# EAGLE design Servo (EAGLE 9.6.2)
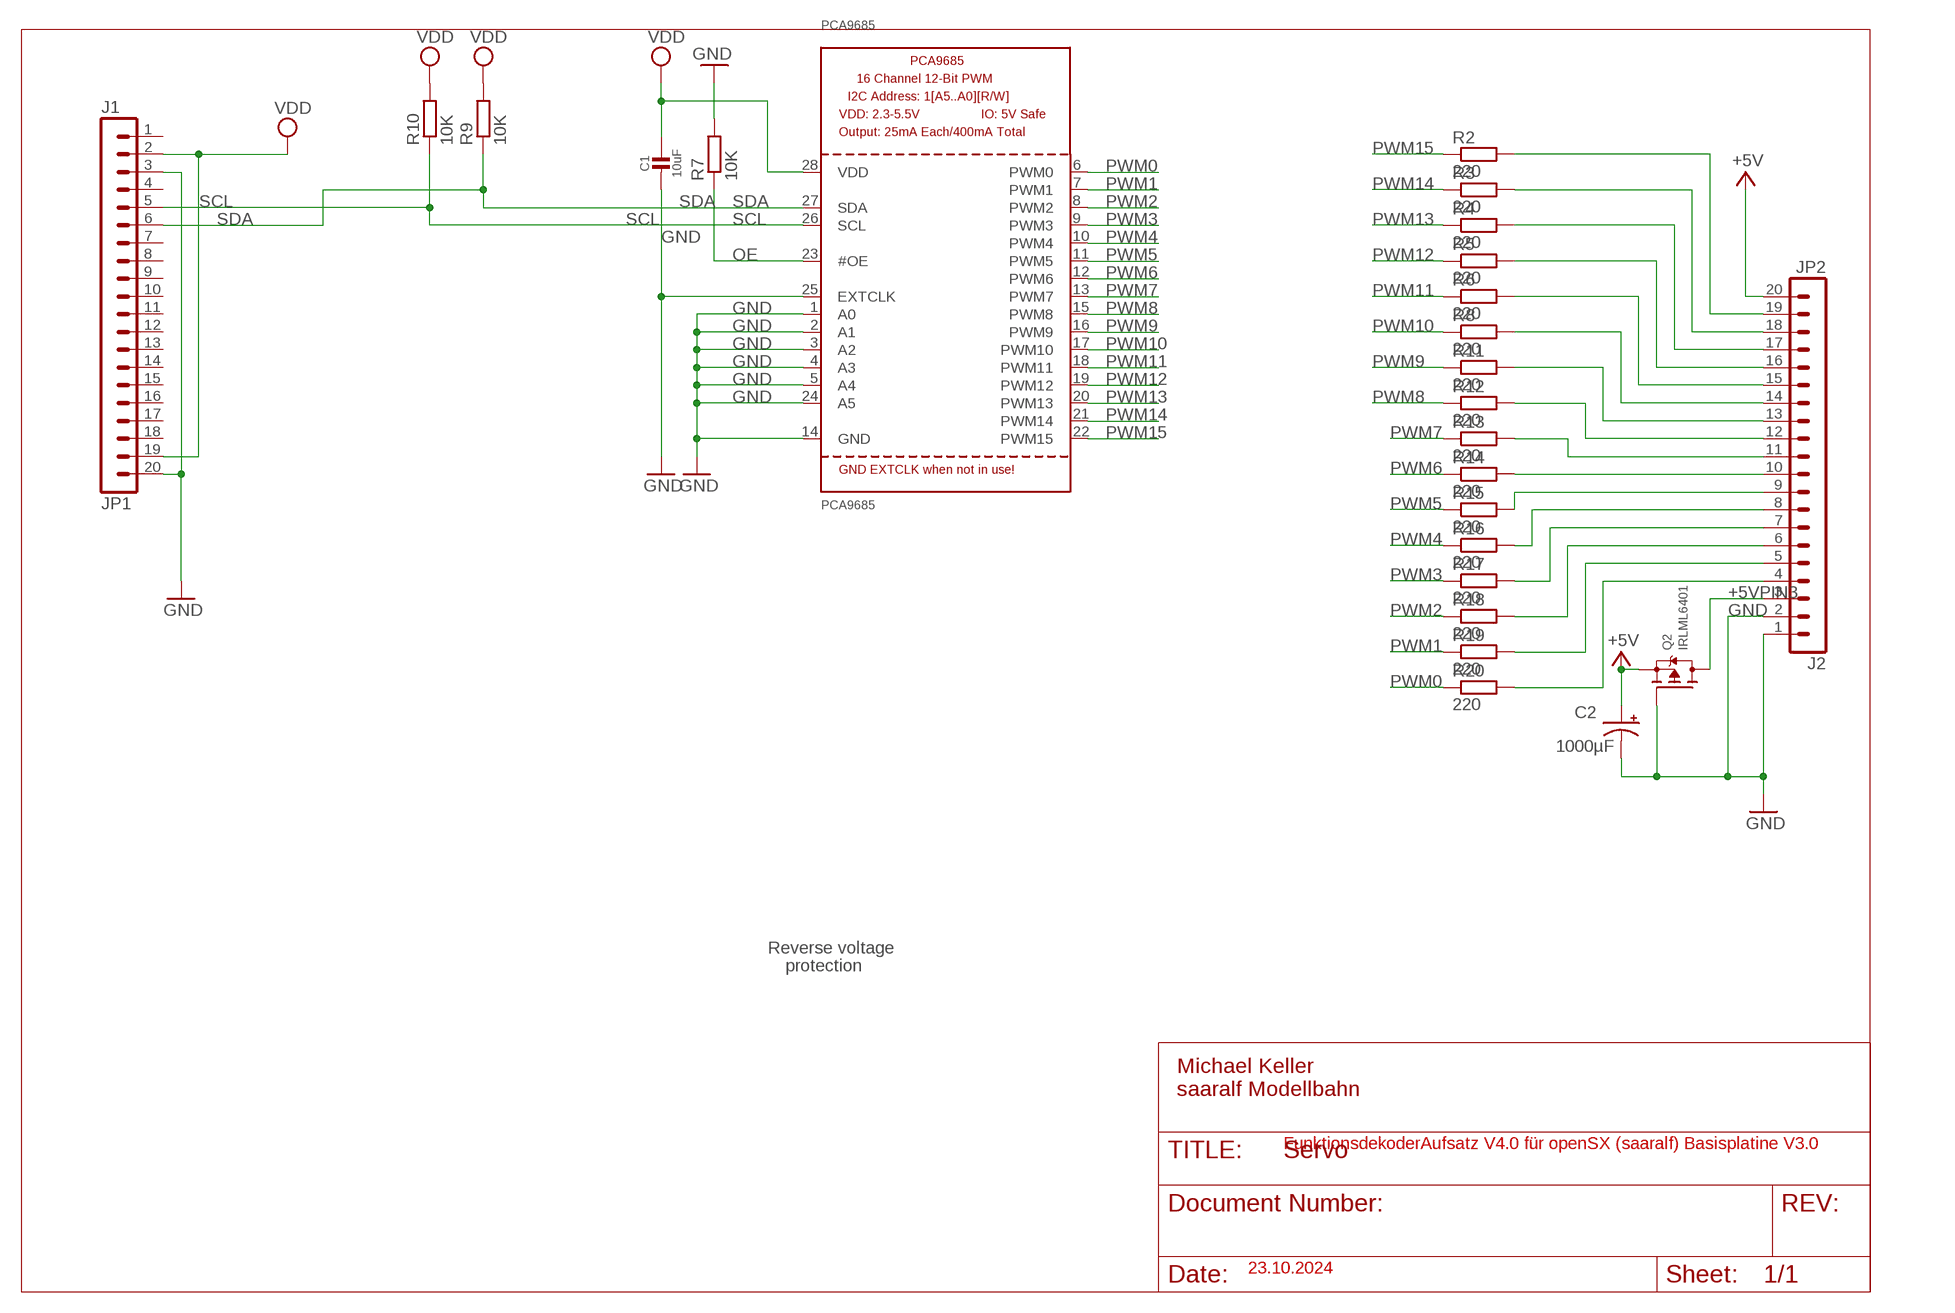
[diagram p0: schematic, sheet 1]

## Parts
C1  10uF  CAP_CERAMIC0805-NOOUTLINE  [0805-NO]
C2  1000µF  CPOL-USE3.5-8  [E3,5-8]
JP1  J1  MA20-1  [MA20-1]
JP2  J2  MA20-1  [MA20-1]
PCA9685  PCA9685  [TSSOP28]
Q2  IRLML6401  MOSFET-PWIDE  [SOT23-WIDE]
R2  220  R-EU_M0805  [M0805]
R3  220  R-EU_M0805  [M0805]
R4  220  R-EU_M0805  [M0805]
R5  220  R-EU_M0805  [M0805]
R6  220  R-EU_M0805  [M0805]
R7  10K  R-EU_M0805  [M0805]
R8  220  R-EU_M0805  [M0805]
R9  10K  R-EU_M0805  [M0805]
R10  10K  R-EU_M0805  [M0805]
R11  220  R-EU_M0805  [M0805]
R12  220  R-EU_M0805  [M0805]
R13  220  R-EU_M0805  [M0805]
R14  220  R-EU_M0805  [M0805]
R15  220  R-EU_M0805  [M0805]
R16  220  R-EU_M0805  [M0805]
R17  220  R-EU_M0805  [M0805]
R18  220  R-EU_M0805  [M0805]
R19  220  R-EU_M0805  [M0805]
R20  220  R-EU_M0805  [M0805]

## Nets
+5V: C2.+ JP2.20 Q2.2(S)
+5VPIN3: JP2.3 Q2.3(D)
GND: C1.2 C2.- JP1.3 JP1.20 JP2.1 JP2.2 PCA9685.1(A0) PCA9685.2(A1) PCA9685.3(A2) PCA9685.4(A3) PCA9685.5(A4) PCA9685.14(GND) PCA9685.24(A5) PCA9685.25(EXTCLK) Q2.1(G) R7.2
N$2: JP2.17 R4.2
N$3: JP2.11 R13.2
N$4: JP2.10 R14.2
N$5: JP2.9 R15.2
N$6: JP2.7 R17.2
N$7: JP2.6 R18.2
N$8: JP2.5 R19.2
N$9: JP2.4 R20.2
N$10: JP2.15 R6.2
N$11: JP2.14 R8.2
N$12: JP2.18 R3.2
N$13: JP2.13 R11.2
N$14: JP2.19 R2.2
N$15: JP2.8 R16.2
N$17: JP2.16 R5.2
N$18: JP2.12 R12.2
OE: PCA9685.23(#OE) R7.1
PWM0: PCA9685.6(PWM0) R20.1
PWM1: PCA9685.7(PWM1) R19.1
PWM2: PCA9685.8(PWM2) R18.1
PWM3: PCA9685.9(PWM3) R17.1
PWM4: PCA9685.10(PWM4) R16.1
PWM5: PCA9685.11(PWM5) R15.1
PWM6: PCA9685.12(PWM6) R14.1
PWM7: PCA9685.13(PWM7) R13.1
PWM8: PCA9685.15(PWM8) R12.1
PWM9: PCA9685.16(PWM9) R11.1
PWM10: PCA9685.17(PWM10) R8.1
PWM11: PCA9685.18(PWM11) R6.1
PWM12: PCA9685.19(PWM12) R5.1
PWM13: PCA9685.20(PWM13) R4.1
PWM14: PCA9685.21(PWM14) R3.1
PWM15: PCA9685.22(PWM15) R2.1
SCL: JP1.5 PCA9685.26(SCL) R10.1
SDA: JP1.6 PCA9685.27(SDA) R9.1
VDD: C1.1 JP1.2 JP1.19 PCA9685.28(VDD) R9.2 R10.2
Unconnected: JP1.1 JP1.4 JP1.7 JP1.8 JP1.9 JP1.10 JP1.11 JP1.12 JP1.13 JP1.14 JP1.15 JP1.16 JP1.17 JP1.18

## Notes on the sheet
- Reverse voltage
- protection
- Michael Keller
  saaralf Modellbahn
- FunktionsdekoderAufsatz V4.0 für openSX (saaralf) Basisplatine V3.0
- 23.10.2024

## Library data of the parts
C1 = microbuilder:CAP_CERAMIC: Ceramic Capacitors For new designs, use the packages preceded by an '_' character since they are more reliable: The following footprints should be used on most boards: _0402 - Standard footprint for regular board layouts _0603 - Standard footprint for regular board layouts _0805 - Standard footprint for regular board layouts _1206 - Standard footprint for regular board layouts For extremely tight-pitch boards where space is at a premium, the following 'micro-pitch' footprints can be used (smaller pads, no silkscreen outline, etc.): _0402MP - Micro-pitch footprint for very dense/compact boards _0603MP - Micro-pitch footprint for very dense/compact boards _0805MP - Micro-pitch footprint for very dense/compact boards _1206MP - Micro-pitch footprint for very dense/compact boards
C2 = adafruit:CPOL-US: POLARIZED CAPACITOR, American symbol
JP1 JP2 = con-lstb:MA20-1: PIN HEADER; OC_FARNELL: unknown; OC_NEWARK: unknown
PCA9685 = microbuilder:PCA9685: PCA9685 - 16 Channel 12-Bit I2C PWM Controller 5.0V tolerant 16 channel, 12-bit I2C PWM controller with 25mA per output (max. 400mA total) Digikey: 568-5931-1-ND
Q2 = microbuilder:MOSFET-P: P-Channel Mosfet LEGEND VDS: Voltage Drain-Source ID: Drain Current RDS(ON): Drain-Source On-State Resistance VGS(TH): Gate-Source Threshold Voltage CISS: Drain-Source Input Capacitance SOT-23 Name VDS ID RDS(ON) VGS(TH) CISS Order Number IRLML5103 30V 760mA 600 mOhm -- 75pF @ 25V Digikey: IRLML5103PBFCT-ND NTR0202PL 20V 400mA 800 mOhm 2.3V @ 250uA 70pF @ 5V Digikey: NTR0202PLT1GOSTR-ND NTR4101PT1G 20V 1.8A 85 mOhm 1.2V @ 250uA 675pF @ 10V Digikey: NTR4101PT1GOSCT-ND DMP2004K 20V 600mA 900 mOhm 1V @ 250uA 175pF @ 16V Digikey: DMP2004KDICT-ND PMV65XP 20V 3.9A 76 mOhm 950mV @ 1mA 725pF @ 20V Digikey: 568-2358-2-ND TO-252 Name VDS ID RDS(ON) VGS(TH) CISS Order Number AOD417 30V 25A 34 mOhm 3V @ 250µA 920pF @ 15V Digikey: 785-1106-2-ND
R2-R20 = rcl:R-EU_: RESISTOR, European symbol; SPICEPREFIX: R

## Board
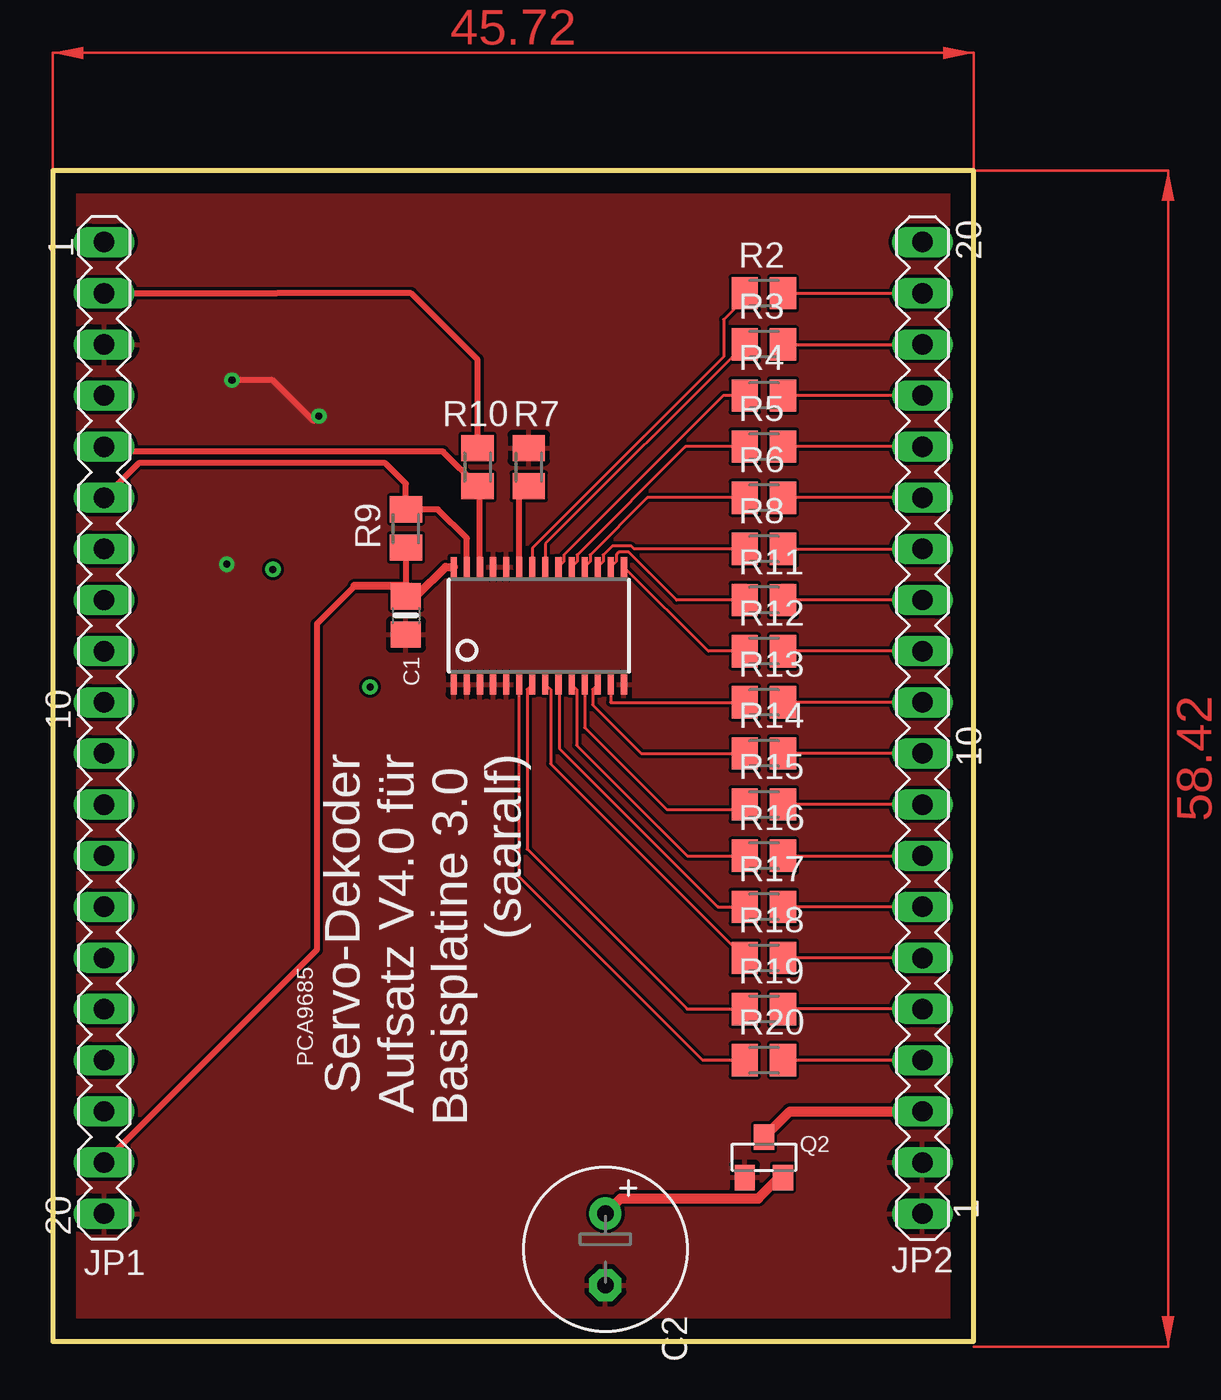
[diagram p1: board, top side]
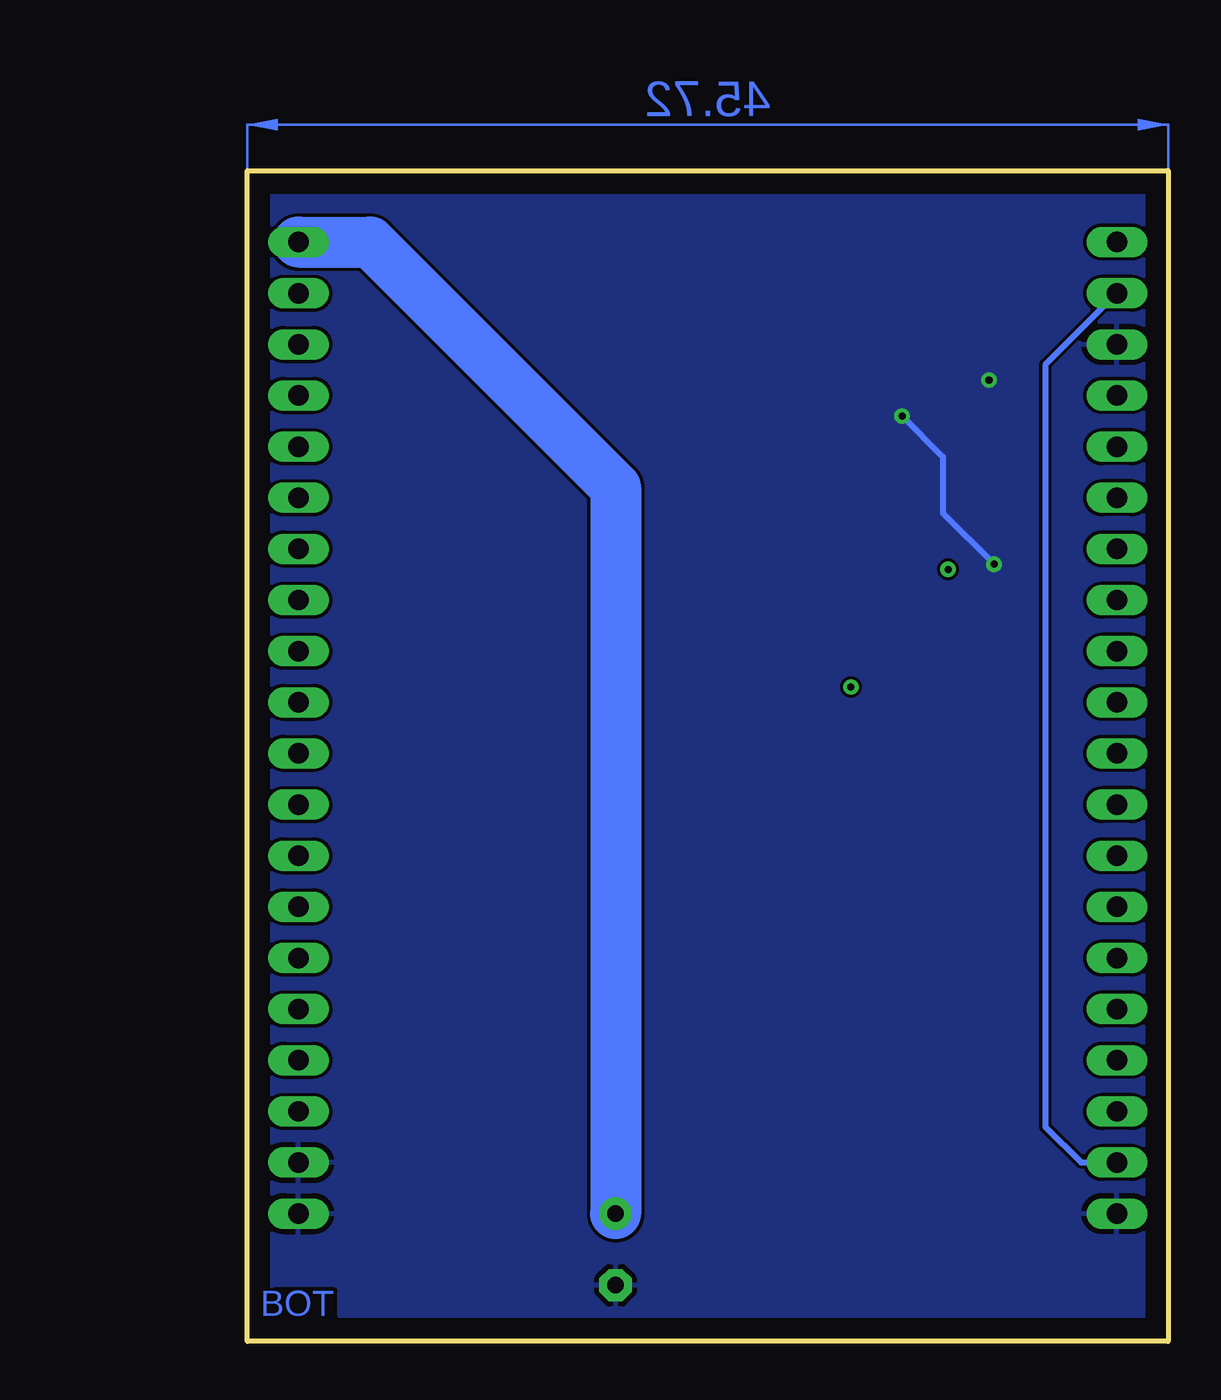
[diagram p2: board, bottom side, seen from below]

Size 45.72 x 58.17 mm. Coordinates in mm from the lower left corner, seen from the top.
Outline: 0,0 45.72,0 45.72,58.17 0,58.17 0,0
Copper layers (1*16): Top 0.035mm / dielectric 1.5mm / Bottom 0.035mm
Design rules "default": minimum track width 6mil, minimum drill 0.35mm, track to track 6mil, track to pad 6mil, pad to pad 6mil, via to via 6mil, smd to smd 6mil, copper to edge 40mil, drill to drill 6mil, minimum pad ring 10mil, minimum via ring 8mil, stop-mask expansion 4mil, vias tented up to drill 0mil, thermal gap 10mil

### Footprints (pad centres in the part's own frame; a part is rotated, then mirrored left to right if it is on the bottom)
0805-NO = smd 1.3 x 1.5: 1 -0.95,0; 2 0.95,0
E3,5-8 = drill 0.813 pad 1.6: + -1.778,0 | drill 0.813 pad 1.6 octagon: - 1.778,0
MA20-1 = drill 1.016 long: 1 -24.13,0; 2 -21.59,0; 3 -19.05,0; 4 -16.51,0; 5 -13.97,0; 6 -11.43,0; 7 -8.89,0; 8 -6.35,0; 9 -3.81,0; 10 -1.27,0; 11 1.27,0; 12 3.81,0; 13 6.35,0; 14 8.89,0; 15 11.43,0; 16 13.97,0; 17 16.51,0; 18 19.05,0; 19 21.59,0; 20 24.13,0
TSSOP28 = smd 0.305 x 0.991: 1 -4.225,-2.918; 2 -3.575,-2.918; 3 -2.925,-2.918; 4 -2.275,-2.918; 5 -1.625,-2.918; 6 -0.975,-2.918; 7 -0.325,-2.918; 8 0.325,-2.918; 9 0.975,-2.918; 10 1.625,-2.918; 11 2.275,-2.918; 12 2.925,-2.918; 13 3.575,-2.918; 14 4.225,-2.918; 15 4.225,2.918; 16 3.575,2.918; 17 2.925,2.918; 18 2.275,2.918; 19 1.625,2.918; 20 0.975,2.918; 21 0.325,2.918; 22 -0.325,2.918; 23 -0.975,2.918; 24 -1.625,2.918; 25 -2.275,2.918; 26 -2.925,2.918; 27 -3.575,2.918; 28 -4.225,2.918
SOT23-WIDE = smd 1 x 1.27: 1 -0.95,-1; 2 0.95,-1; 3 0,1
M0805 = smd 1.3 x 1.6: 1 -0.95,0; 2 0.95,0

### Placement (x,y rotation side)
C1  17.53,36.07 270 top
C2  27.43,4.57 270 top
JP1  2.54,30.48 270 top
JP2  43.18,30.48 90 top
PCA9685  24.13,35.56 0 top
Q2  35.31,9.14 0 top
R2  35.31,52.07 0 top
R3  35.31,49.53 0 top
R4  35.31,46.99 0 top
R5  35.31,44.45 0 top
R6  35.31,41.91 0 top
R7  23.62,43.43 90 top
R8  35.31,39.37 0 top
R9  17.53,40.39 270 top
R10  21.08,43.43 90 top
R11  35.31,36.83 0 top
R12  35.31,34.29 0 top
R13  35.31,31.75 0 top
R14  35.31,29.21 0 top
R15  35.31,26.67 0 top
R16  35.31,24.13 0 top
R17  35.31,21.59 0 top
R18  35.31,19.05 0 top
R19  35.31,16.51 0 top
R20  35.31,13.97 0 top

### Tracks (layer width: path | path; a pad name or v marks a point on that pad's centre or on a via)
+5V
  Top 0.508: Q2.2 36.07,8.14 35.02,7.1 28.18,7.1 C2.+
  Bottom 2.54: JP2.20 39.62,54.61 27.43,42.42 C2.+
+5VPIN3
  Top 0.508: Q2.3 36.59,11.43 JP2.3
GND  (via drill 0.35)
  Top 0.254: PCA9685.2 20.59,32.61 20.59,32.29
  Top 0.305: v13.21,45.97 12.95,45.72 10.92,47.75 v8.89,47.75
  Bottom 0.305: v13.21,45.97 11.18,43.94 11.18,41.15 v8.64,38.61
  pour Top: 45.97,58.42 45.97,0.25 45.72,0 0,0 0.26,58.42
  pour Bottom: 0,58.17 45.47,58.17 45.72,58.42 45.72,0 0,0
N$1  (via drill 0.35)
  other vias: 10.92,38.35
N$2
  Top 0.152: JP2.17 R4.2
N$3
  Top 0.152: JP2.11 R13.2
N$4
  Top 0.152: JP2.10 R14.2
N$5
  Top 0.152: JP2.9 R15.2
N$6
  Top 0.152: JP2.7 R17.2
N$7
  Top 0.152: JP2.6 R18.2
N$8
  Top 0.152: JP2.5 R19.2
N$9
  Top 0.152: JP2.4 R20.2
N$10
  Top 0.152: JP2.15 R6.2
N$11
  Top 0.152: R8.2 JP2.14
N$12
  Top 0.152: R3.2 JP2.18
N$13
  Top 0.152: JP2.13 R11.2
N$14
  Top 0.152: R2.2 JP2.19
N$15
  Top 0.152: R16.2 JP2.8
N$16  (via drill 0.35)
  other vias: 15.75,32.51
N$17
  Top 0.152: JP2.16 R5.2
N$18
  Top 0.152: JP2.12 R12.2
OE
  Top 0.305: PCA9685.23 23.16,42.02 R7.1
PWM0
  Top 0.152: R20.1 32.26,13.97 23.16,23.07 PCA9685.6
PWM1
  Top 0.152: PCA9685.7 23.55,32.39 23.55,24.45 31.5,16.51 R19.1
PWM2
  Top 0.152: R18.1 24.71,28.7 24.71,32.39 PCA9685.8
PWM3
  Top 0.152: PCA9685.9 25.15,32.6 25.15,29.46 33.02,21.59 R17.1
PWM4
  Top 0.152: PCA9685.10 26.01,32.39 26.01,29.62 31.5,24.13 R16.1
PWM5
  Top 0.152: PCA9685.11 26.41,30.49 30.48,26.42 34.1,26.42 R15.1
PWM6
  Top 0.152: PCA9685.12 26.8,32.39 26.8,31.62 29.21,29.21 R14.1
PWM7
  Top 0.152: PCA9685.13 27.7,31.77 27.69,31.75 R13.1
PWM8
  Top 0.152: R12.1 32.54,34.29 PCA9685.15
PWM9
  Top 0.152: PCA9685.16 27.97,38.75 27.97,39.07 28.11,39.2 28.6,39.2 30.97,36.83 R11.1
PWM10
  Top 0.152: R8.1 28.86,39.37 28.73,39.51 27.76,39.51 27.32,39.07 27.32,38.75 PCA9685.17
PWM11
  Top 0.152: PCA9685.18 26.67,38.75 26.67,39.07 29.52,41.91 R6.1
PWM12
  Top 0.152: PCA9685.19 26.02,38.75 26.02,39.07 31.41,44.45 R5.1
PWM13
  Top 0.152: PCA9685.20 25.37,38.75 25.37,39.07 33.3,46.99 R4.1
PWM14
  Top 0.152: R3.1 24.45,39.63 PCA9685.21
PWM15
  Top 0.152: R2.1 34.36,51.82 33.31,50.77 33.31,48.91 23.8,39.41 PCA9685.22
SCL
  Top 0.305: PCA9685.26 21.2,42.36 R10.1 19.39,44.17 19.39,44.2 2.79,44.2 JP1.5
SDA
  Top 0.305: PCA9685.27 20.55,39.9 19.12,41.34 R9.1 17.53,42.61 16.51,43.62 4.25,43.62 JP1.6
VDD
  Top 0.305: JP1.19 13.1,19.45 13.1,35.64 14.99,37.53 | JP1.2 10.67,52.07 11.11,52.07 17.78,52.07 21.08,48.77 R10.2 | R9.2 17.53,37.08
  Top 0.406: 14.99,37.53 17.53,37.53 17.53,37.08 C1.1 18.03,37.02 19.49,38.48 PCA9685.28
  Bottom 0.305: JP1.2 6.1,48.51 6.1,10.67 4.32,8.89 JP1.19
(copper drawn outside any net)
  shapes: Bottom area x1, Top area x2

### Text on the board
Bottom: BOT
tNames: Servo-Dekoder / Aufsatz V4.0 für / Basisplatine 3.0 / (saaralf)